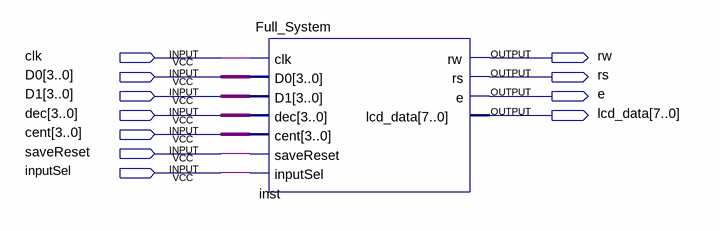
[diagram p0: schematic sheet]
// Quartus schematic FP_Multi.bdf as structural Verilog: 1 symbols, 11 pins
module FP_Multi (
  input  clk,
  input  [3:0] D0,
  input  [3:0] D1,
  input  [3:0] dec,
  input  [3:0] cent,
  input  saveReset,
  input  inputSel,
  output rw,
  output rs,
  output e,
  output [7:0] lcd_data
);

  Full_System inst (
    .clk(clk), .D0(D0), .D1(D1), .dec(dec), .cent(cent), .saveReset(saveReset), .inputSel(inputSel), .rw(rw),
    .rs(rs), .e(e), .lcd_data(lcd_data));
endmodule
